# Altium schematic sheet boardSheet.SchDoc
size A2; SheetNumber: 1; SheetTotal: 1
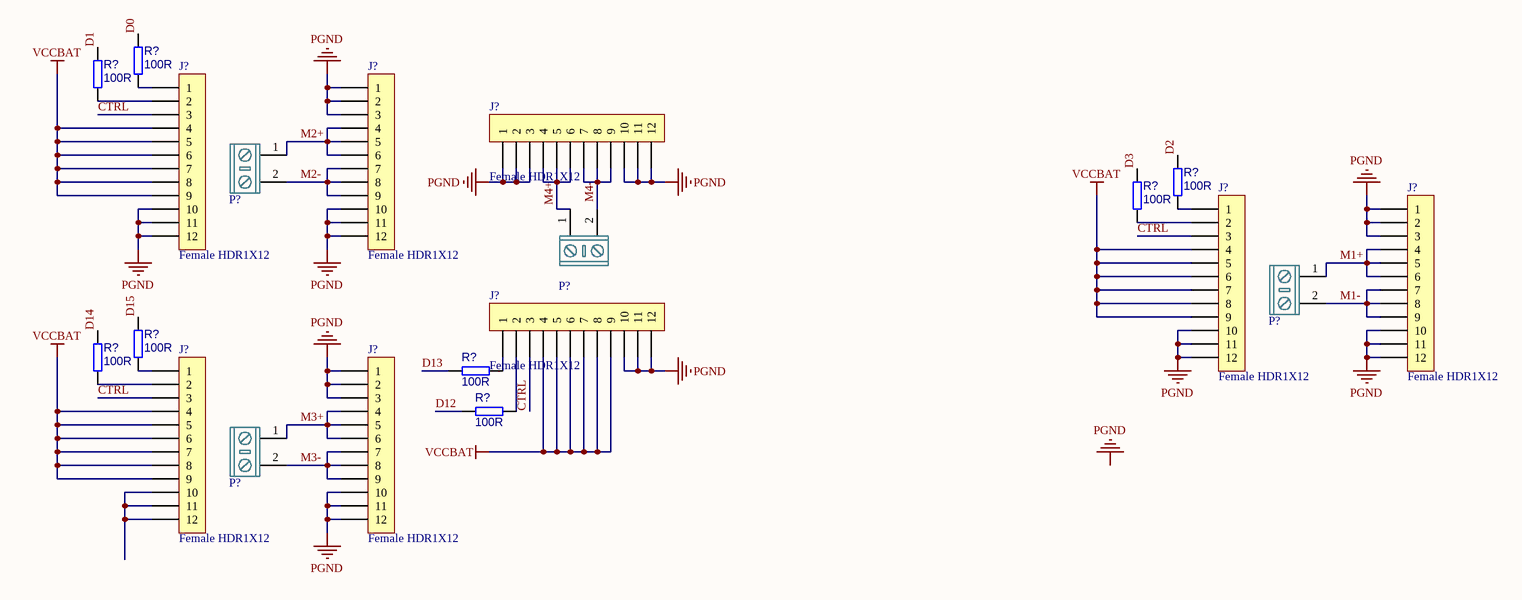
[diagram p0: boardSheet.SchDoc]

## Parts
(Parts that share a designator on the sheet are numbered #1, #2 ... from top to bottom, then left to right.)
J?#1  Female HDR1X12  [Fe-HDR1X12/2.54-S]
J?#2  Female HDR1X12  [Fe-HDR1X12/2.54-S]
J?#3  Female HDR1X12  [Fe-HDR1X12/2.54-S]
J?#4  Female HDR1X12  [Fe-HDR1X12/2.54-S]
J?#5  Female HDR1X12  [Fe-HDR1X12/2.54-S]
J?#6  Female HDR1X12  [Fe-HDR1X12/2.54-S]
J?#7  Female HDR1X12  [Fe-HDR1X12/2.54-S]
J?#8  Female HDR1X12  [Fe-HDR1X12/2.54-S]
P?#1  KF/WJ/DG 30x connecter  [XT30-M]  (value not drawn)
P?#2  KF/WJ/DG 30x connecter  [XT30-M]  (value not drawn)
P?#3  KF/WJ/DG 30x connecter  [XT30-M]  (value not drawn)
P?#4  KF/WJ/DG 30x connecter  [XT30-M]  (value not drawn)
R?#1  value 100R  [RESC1608[0603]S-L]  (hidden comment: 100R ±1%)
R?#2  value 100R  [RESC1608[0603]S-L]  (hidden comment: 100R ±1%)
R?#3  value 100R  [RESC1608[0603]S-L]  (hidden comment: 100R ±1%)
R?#4  value 100R  [RESC1608[0603]S-L]  (hidden comment: 100R ±1%)
R?#5  value 100R  [RESC1608[0603]S-L]  (hidden comment: 100R ±1%)
R?#6  value 100R  [RESC1608[0603]S-L]  (hidden comment: 100R ±1%)
R?#7  value 100R  [RESC1608[0603]S-L]  (hidden comment: 100R ±1%)
R?#8  value 100R  [RESC1608[0603]S-L]  (hidden comment: 100R ±1%)

## Nets
PGND: J?#1.10 J?#1.11 J?#1.12 J?#2.1 J?#2.2 J?#2.3 J?#2.10 J?#2.11 J?#2.12 J?#3.1 J?#3.2 J?#3.3 J?#3.10 J?#3.11 J?#3.12 J?#4.10 J?#4.11 J?#4.12 J?#5.1 J?#5.2 J?#5.3 J?#5.10 J?#5.11 J?#5.12 J?#6.10 J?#6.11 J?#6.12 J?#8.1 J?#8.2 J?#8.3 J?#8.10 J?#8.11 J?#8.12
VCCBAT: J?#1.4 J?#1.5 J?#1.6 J?#1.7 J?#1.8 J?#1.9 J?#4.4 J?#4.5 J?#4.6 J?#4.7 J?#4.8 J?#4.9 J?#6.4 J?#6.5 J?#6.6 J?#6.7 J?#6.8 J?#6.9 J?#7.4 J?#7.5 J?#7.6 J?#7.7 J?#7.8 J?#7.9
CTRL: J?#1.3 J?#4.3 J?#6.3 J?#7.3
D0: R?#1.1
D1: R?#2.1
D2: R?#3.1
D3: R?#4.1
D12: R?#8.1
D13: R?#7.1
D14: R?#6.1
D15: R?#5.1
M1+: J?#5.4 J?#5.5 J?#5.6 P?#3.1
M1-: J?#5.7 J?#5.8 J?#5.9 P?#3.2
M2+: J?#2.4 J?#2.5 J?#2.6 P?#1.1
M2-: J?#2.7 J?#2.8 J?#2.9 P?#1.2
M3+: J?#8.4 J?#8.5 J?#8.6 P?#4.1
M3-: J?#8.7 J?#8.8 J?#8.9 P?#4.2
M4+: J?#3.4 J?#3.5 J?#3.6 P?#2.1
M4-: J?#3.7 J?#3.8 J?#3.9 P?#2.2
NetJ?#1_1: J?#1.1 R?#1.2
NetJ?#1_2: J?#1.2 R?#2.2
NetJ?#4_1: J?#4.1 R?#3.2
NetJ?#4_2: J?#4.2 R?#4.2
NetJ?#6_1: J?#6.1 R?#7.2
NetJ?#6_2: J?#6.2 R?#8.2
NetJ?#7_1: J?#7.1 R?#5.2
NetJ?#7_2: J?#7.2 R?#6.2
NetJ?#7_10: J?#7.10 J?#7.11 J?#7.12

## Notes on the sheet
- Labels drawn without touching a wire or pin: PGND

## Library data of the parts
J?#1-J?#8 = Female HDR1X12: 1X12Pin,直插排母
P?#1-P?#4 = KF/WJ/DG 30x: 接线端子 2Pin
R?#1-R?#8 = Res-Chip: 贴片电阻; Power: 1/8W; Revision: V1.0; Tolerance: ±1%